# EAGLE schematic placa3 (EAGLE 7.3.0)
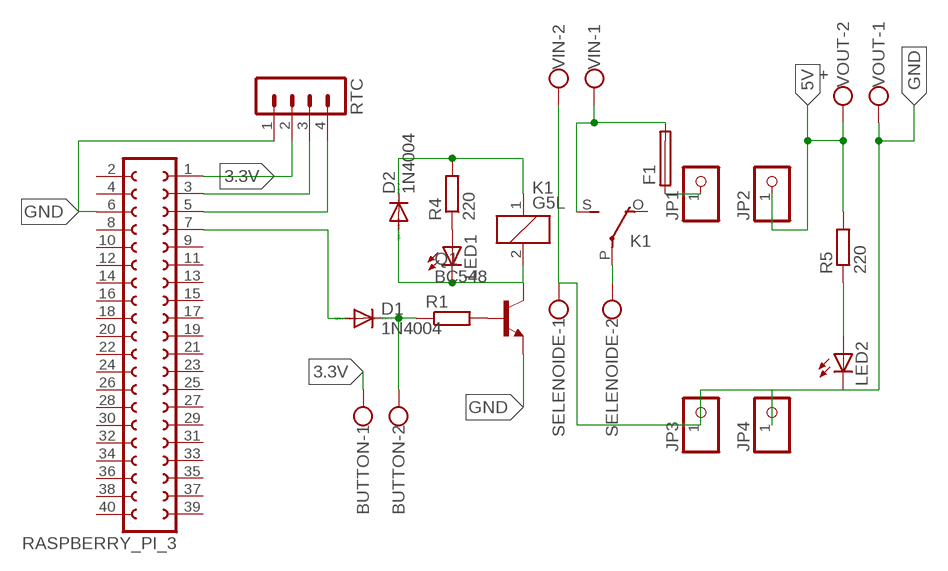
[diagram p0: schematic, sheet 1]

## Parts
BUTTON  W237-102  [W237-102]
D1  1N4004  [DO41-10]
D2  1N4004  [DO41-10]
F1  SH22,5  [SH22,5]
JP1  PINHD-1X1  [1X01]
JP2  PINHD-1X1  [1X01]
JP3  PINHD-1X1  [1X01]
JP4  PINHD-1X1  [1X01]
K1  G5L  [G5LE]
LED1  LED5MM  [LED5MM]
LED2  LED5MM  [LED5MM]
Q1  BC548  [TO92-EBC]
R1  R-EU_0204/7  [0204/7]
R4  220  R-EU_0204/7  [0204/7]
R5  220  R-EU_0204/7  [0204/7]
RASPBERRY_PI_3  FE20-2  [FE20-2]
RTC  MA04-1  [MA04-1]
SELENOIDE  W237-102  [W237-102]
VIN  W237-102  [W237-102]
VOUT  +  W237-102  [W237-102]

## Nets
3.3V: BUTTON.1 RASPBERRY_PI_3.1 RTC.2
5V: D2.C JP2.1 K1.1 R4.2 R5.2 VOUT.2
GND: JP3.1 JP4.1 LED2.K(C) Q1.E RASPBERRY_PI_3.6 RTC.1 SELENOIDE.1 VIN.2 VOUT.1
GPIO02: RASPBERRY_PI_3.3 RTC.3
GPIO03: RASPBERRY_PI_3.5 RTC.4
GPIO04: D1.A RASPBERRY_PI_3.7
N$1: BUTTON.2 D1.C R1.1
N$4: Q1.B R1.2
N$5: K1.P(2:P) SELENOIDE.2
N$6: D2.A K1.2 LED1.K(C) Q1.C
N$7: LED2.A R5.1
N$9: F1.2 K1.S(2:S) VIN.1
N$10: F1.1 JP1.1
N$82: LED1.A R4.1
Unconnected: K1.O(2:O) RASPBERRY_PI_3.2 RASPBERRY_PI_3.4 RASPBERRY_PI_3.8 RASPBERRY_PI_3.9 RASPBERRY_PI_3.10 RASPBERRY_PI_3.11 RASPBERRY_PI_3.12 RASPBERRY_PI_3.13 RASPBERRY_PI_3.14 RASPBERRY_PI_3.15 RASPBERRY_PI_3.16 RASPBERRY_PI_3.17 RASPBERRY_PI_3.18 RASPBERRY_PI_3.19 RASPBERRY_PI_3.20 RASPBERRY_PI_3.21 RASPBERRY_PI_3.22 RASPBERRY_PI_3.23 RASPBERRY_PI_3.24 RASPBERRY_PI_3.25 RASPBERRY_PI_3.26 RASPBERRY_PI_3.27 RASPBERRY_PI_3.28 RASPBERRY_PI_3.29 RASPBERRY_PI_3.30 RASPBERRY_PI_3.31 RASPBERRY_PI_3.32 RASPBERRY_PI_3.33 RASPBERRY_PI_3.34 RASPBERRY_PI_3.35 RASPBERRY_PI_3.36 RASPBERRY_PI_3.37 RASPBERRY_PI_3.38 RASPBERRY_PI_3.39 RASPBERRY_PI_3.40

## Library data of the parts
BUTTON SELENOIDE VIN VOUT = con-wago-500:W237-102: WAGO SCREW CLAMP; MPN: 237-102; OC_FARNELL: unknown; OC_NEWARK: 70K9898
D1 D2 = diode:1N4004: DIODE general purpose rectifier, 1 A
F1 = fuse:SH22,5: FUSE HOLDER grid 22,5 mm, OGN0031 8201, Schurter (Buerklin); MF: SCHURTER; MPN: 0031.8201; OC_FARNELL: 1162740; OC_NEWARK: 96F8317
JP1-JP4 = pinhead:PINHD-1X1: PIN HEADER
K1 = relay:G5L: RELAY 1 x switch, 10 A/120 V AC, 8 A/30 V ADC, Omron; OC_FARNELL: unknown; OC_NEWARK: unknown
LED1 LED2 = led:LED: LED OSRAM: - CHIPLED LG R971, LG N971, LY N971, LG Q971, LY Q971, LO R971, LY R971 LH N974, LH R974 LS Q976, LO Q976, LY Q976 LO Q996 - Hyper CHIPLED LW Q18S LB Q993, LB Q99A, LB R99A - SideLED LS A670, LO A670, LY A670, LG A670, LP A670 LB A673, LV A673, LT A673, LW A673 LH A674 LY A675 LS A676, LA A676, LO A676, LY A676, LW A676 LS A679, LY A679, LG A679 - Hyper Micro SIDELED® LS Y876, LA Y876, LO Y876, LY Y876 LT Y87S - SmartLED LW L88C, LW L88S LB L89C, LB L89S, LG L890 LS L89K, LO L89K, LY L89K LS L896, LA L896, LO L896, LY L896 - TOPLED LS T670, LO T670, LY T670, LG T670, LP T670 LSG T670, LSP T670, LSY T670, LOP T670, LYG T670 LG T671, LOG T671, LSG T671 LB T673, LV T673, LT T673, LW T673 LH T674 LS T676, LA T676, LO T676, LY T676, LB T676, LH T676, LSB T676, LW T676 LB T67C, LV T67C, LT T67C, LS T67K, LO T67K, LY T67K, LW E67C LS E67B, LA E67B, LO E67B, LY E67B, LB E67C, LV E67C, LT E67C LW T67C LS T679, LY T679, LG T679 LS T770, LO T770, LY T770, LG T770, LP T770 LB T773, LV T773, LT T773, LW T773 LH T774 LS E675, LA E675, LY E675, LS T675 LS T776, LA T776, LO T776, LY T776, LB T776 LHGB T686 LT T68C, LB T68C - Hyper Mini TOPLED® LB M676 - Mini TOPLED Santana® LG M470 LS M47K, LO M47K, LY M47K Source: http://www.osram.convergy.de LUXEON: - LUMILED® LXK2-PW12-R00, LXK2-PW12-S00, LXK2-PW14-U00, LXK2-PW14-V00 LXK2-PM12-R00, LXK2-PM12-S00, LXK2-PM14-U00 LXK2-PE12-Q00, LXK2-PE12-R00, LXK2-PE12-S00, LXK2-PE14-T00, LXK2-PE14-U00 LXK2-PB12-K00, LXK2-PB12-L00, LXK2-PB12-M00, LXK2-PB14-N00, LXK2-PB14-P00, LXK2-PB14-Q00 LXK2-PR12-L00, LXK2-PR12-M00, LXK2-PR14-Q00, LXK2-PR14-R00 LXK2-PD12-Q00, LXK2-PD12-R00, LXK2-PD12-S00 LXK2-PH12-R00, LXK2-PH12-S00 LXK2-PL12-P00, LXK2-PL12-Q00, LXK2-PL12-R00 Source: www.luxeon.com KINGBRIGHT: KA-3528ASYC Source: www.kingbright.com
Q1 = transistor-npn:BC548*: NPN Transistor
R1 R4 R5 = resistor:R-EU_: RESISTOR, European symbol
RASPBERRY_PI_3 = con-lsta:FE20-2: FEMALE HEADER; OC_FARNELL: unknown; OC_NEWARK: unknown
RTC = con-lstb:MA04-1: PIN HEADER; OC_FARNELL: unknown; OC_NEWARK: unknown